# Altium project MB1936.PrjPcb (part 4 of 8)

## Sheet QSPI_NOR.SchDoc: QSPI_NOR
size A4; Date: Not used; ApprovedBy: Not used; CheckedBy: Not used; Author: Not used; CompanyName: STMicroelectronics; DrawnBy: Not used; Engineer: Not used; Organization: Not used; Address1: Not used; Address2: Not used; Address3: Not used; Address4: Not used; DocumentNumber: Not used; Revision: Not used; SheetNumber: 14; SheetTotal: 18; CurrentTime: Not used; CurrentDate: Not used; Time: Not used; DocumentFullPathAndName: Not used; DocumentName: Not used; ModifiedDate: Not used; ImagePath: Not used; ProjectName: Not used; Application_BuildNumber: Not used
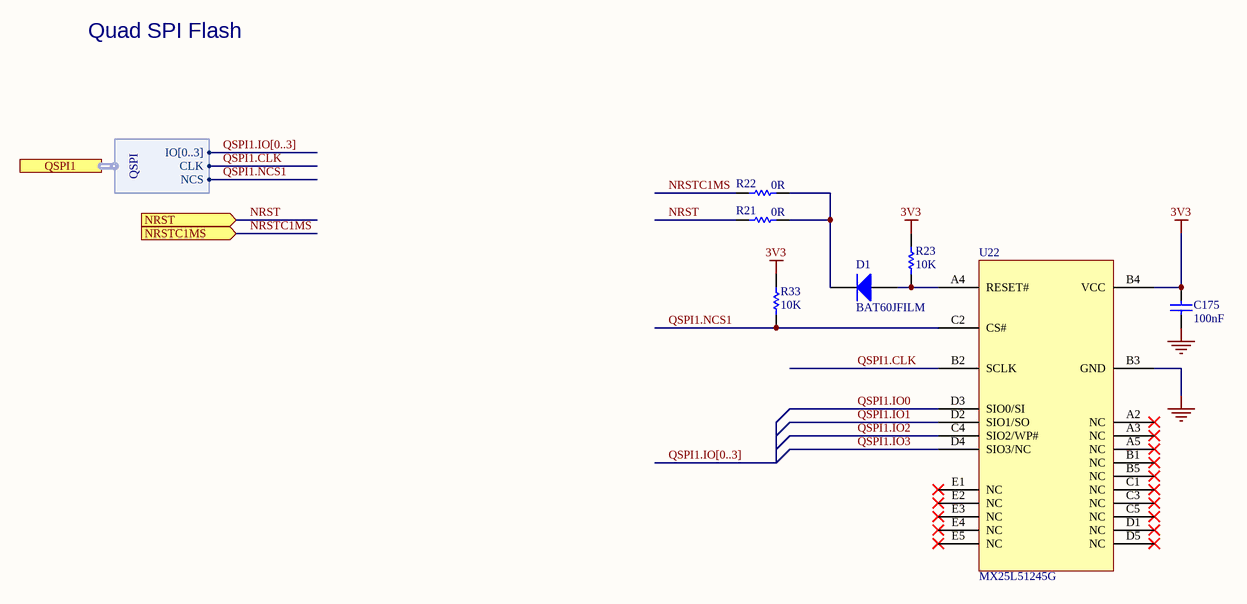
[diagram p10: QSPI_NOR.SchDoc]

### Parts
C175  value 100nF  [C0402]  (hidden comment: Capacitor)
D1  BAT60JFILM  [DIO_SOD323]
R21  value 0R  [R0402]  (hidden comment: Resistor)
R22  value 0R  [R0402]  (hidden comment: Resistor)
R23  value 10K  [R0402]  (hidden comment: Resistor)
R33  value 10K  [R0402]  (hidden comment: Resistor)
U22  MX25L51245G  [ICC_BGA24_5X5-BALL-ARRAY_6X8_P1]

### Ports
NRST (in), NRSTC1MS (in), QSPI1 (harness QSPI)

### Harnesses
QSPI: IO[0..3], CLK, NCS

### Nets
3V3: C175.2 R23.2 R33.2 U22.B4(VCC)
GND: C175.1 U22.B3(GND)
NRST: R21.1 ; port NRST
NRSTC1MS: R22.1 ; port NRSTC1MS
QSPI1.CLK: U22.B2(SCLK) ; port QSPI1.CLK
QSPI1.IO0: U22.D3(SIO0/SI)
QSPI1.IO1: U22.D2(SIO1/SO)
QSPI1.IO2: U22.C4(SIO2/WP#)
QSPI1.IO3: U22.D4(SIO3/NC)
QSPI1.NCS1: R33.1 U22.C2(CS#) ; port QSPI1.NCS
NetD1_1: D1.1(A) R23.1 U22.A4(RESET#)
NetD1_2: D1.2(K) R21.2 R22.2

Not connected (* = marked no-connect by the designer): U22 A2(NC)* A3(NC)* A5(NC)* B1(NC)* B5(NC)* C1(NC)* C3(NC)* C5(NC)* D1(NC)* D5(NC)* E1(NC)* E2(NC)* E3(NC)* E4(NC)* E5(NC)*

### Buses and harness runs
bus QSPI1.IO[0..3]

### Notes on the sheet
- Quad SPI Flash
- Title:
- Project:
- Size:
- Revision:
- Variant:
- A4
- -
- Date:
- Reference:
- Sheet:
- of

### Library data of the parts
C175 = MCD-00006: Capacitor, MLCC, 100nF, 16V, X7R, +/-10%, 0402, T=0.5mm; Part_Preference: Recommended; Manufacturer: YAGEO; Manufacturer_Part_Number: CC0402KRX7R7BB104; Order_Code_RS: 616-9701; Component_Country_Of_Origin: China; ShowFields: YES; ID: 2474; Internal_Part_Number: MCD-00006; Status: Released; Part_Type: Capacitor; Package: 0402; ComponentLink1URL: http://tunmcdsvn.tun.st.com/Component_Documentation_Library/Trunk/Capacitor/YAGEO_X7R_Series; Order_Code_Digikey: 311-1338-1-ND; Order_Code_Farnell: 9402047
D1 = MCD-00034: BMS_Part_Number: 9151097; Part_Type: Diode; Part_Preference: Recommended; Manufacturer: STMICROELECTRONICS; Manufacturer_HQ_COO: EU; Component_Country_Of_Origin: China; ShowFields: YES; ID: 2483; Internal_Part_Number: MCD-00034; Value: BAT60JFILM; Status: Released; Manufacturer_Part_Number: BAT60JFILM; ComponentLink1URL: http://tunmcdsvn.tun.st.com/Component_Datasheet_Library/Trunk/Diodes/STM_Diode_BAT60JFILM-SOD323
R21 R22 = MCD-00052: Resistor,0R,0402,5%,1/16W; Manufacturer_Part_Number: RC0402JR-070RL; Manufacturer: YAGEO; Part_Preference: Recommended; Order_Code_RS: 618-5804; Component_Country_Of_Origin: China; ID: 2540; ShowFields: YES; Internal_Part_Number: MCD-00052; Status: Released; Part_Type: Resistor; ComponentLink1Description: Datasheet; ComponentLink1URL: http://tunmcdsvn.tun.st.com/Component_Documentation_Library/Trunk/Resistor/YAGEO_RC_L_Series; Package: 0402; Order_Code_Digikey: 311-0.0JRCT-ND; Order_Code_Farnell: 9232516RL; Alternate_Manufacturer: N/A; Alternate_Manufacturer_Part_Number: N/A
R23 R33 = MCD-00053: Resistor,10K,0402,1%,1/16W; Manufacturer_Part_Number: RC0402FR-0710KL; Manufacturer: YAGEO; BMS_Part_Number: 9131590; ECCN_US: EAR99; ECCN_EU: NEC; Provided_By: SUBCO; Internal_Part_Number: MCD-00053; Status: Released; Part_Type: Resistor; Package: R0402; ComponentLink1Description: Datasheet; ComponentLink1URL: http://tunmcdsvn.tun.st.com/Component_Datasheet_Library/Trunk/Resistors/Yageo_Resistor_RC0402-series
U22 = MCD-00114: Memory,Serial-NOR,512Mb,3V; Part_Type: IC; Manufacturer: MACRONIX; ECCN_US: tbd; Provided_By: SUBCO; Internal_Part_Number: MCD-00114; Value: MX25L51245G; Status: Released; Manufacturer_Part_Number: MX25L51245G; ComponentLink1Description: Datasheet; ComponentLink1URL: http://tunmcdsvn.tun.st.com/Component_Datasheet_Library/Trunk/IC/Macronix_SerialNOR_MX25L51245Gver13; ECCN_EU: tbd

## Sheet Power_MPU.SchDoc: Power MPU
size A3; Date: Not used; ApprovedBy: Not used; CheckedBy: Not used; Author: Not used; CompanyName: STMicroelectronics; DrawnBy: Not used; Engineer: Not used; Organization: Not used; Address1: Not used; Address2: Not used; Address3: Not used; Address4: Not used; DocumentNumber: Not used; Revision: Not used; SheetNumber: 5; SheetTotal: 18; CurrentTime: Not used; CurrentDate: Not used; Time: Not used; DocumentFullPathAndName: Not used; DocumentName: Not used; ModifiedDate: Not used; ImagePath: Not used; ProjectName: Not used; Application_BuildNumber: Not used
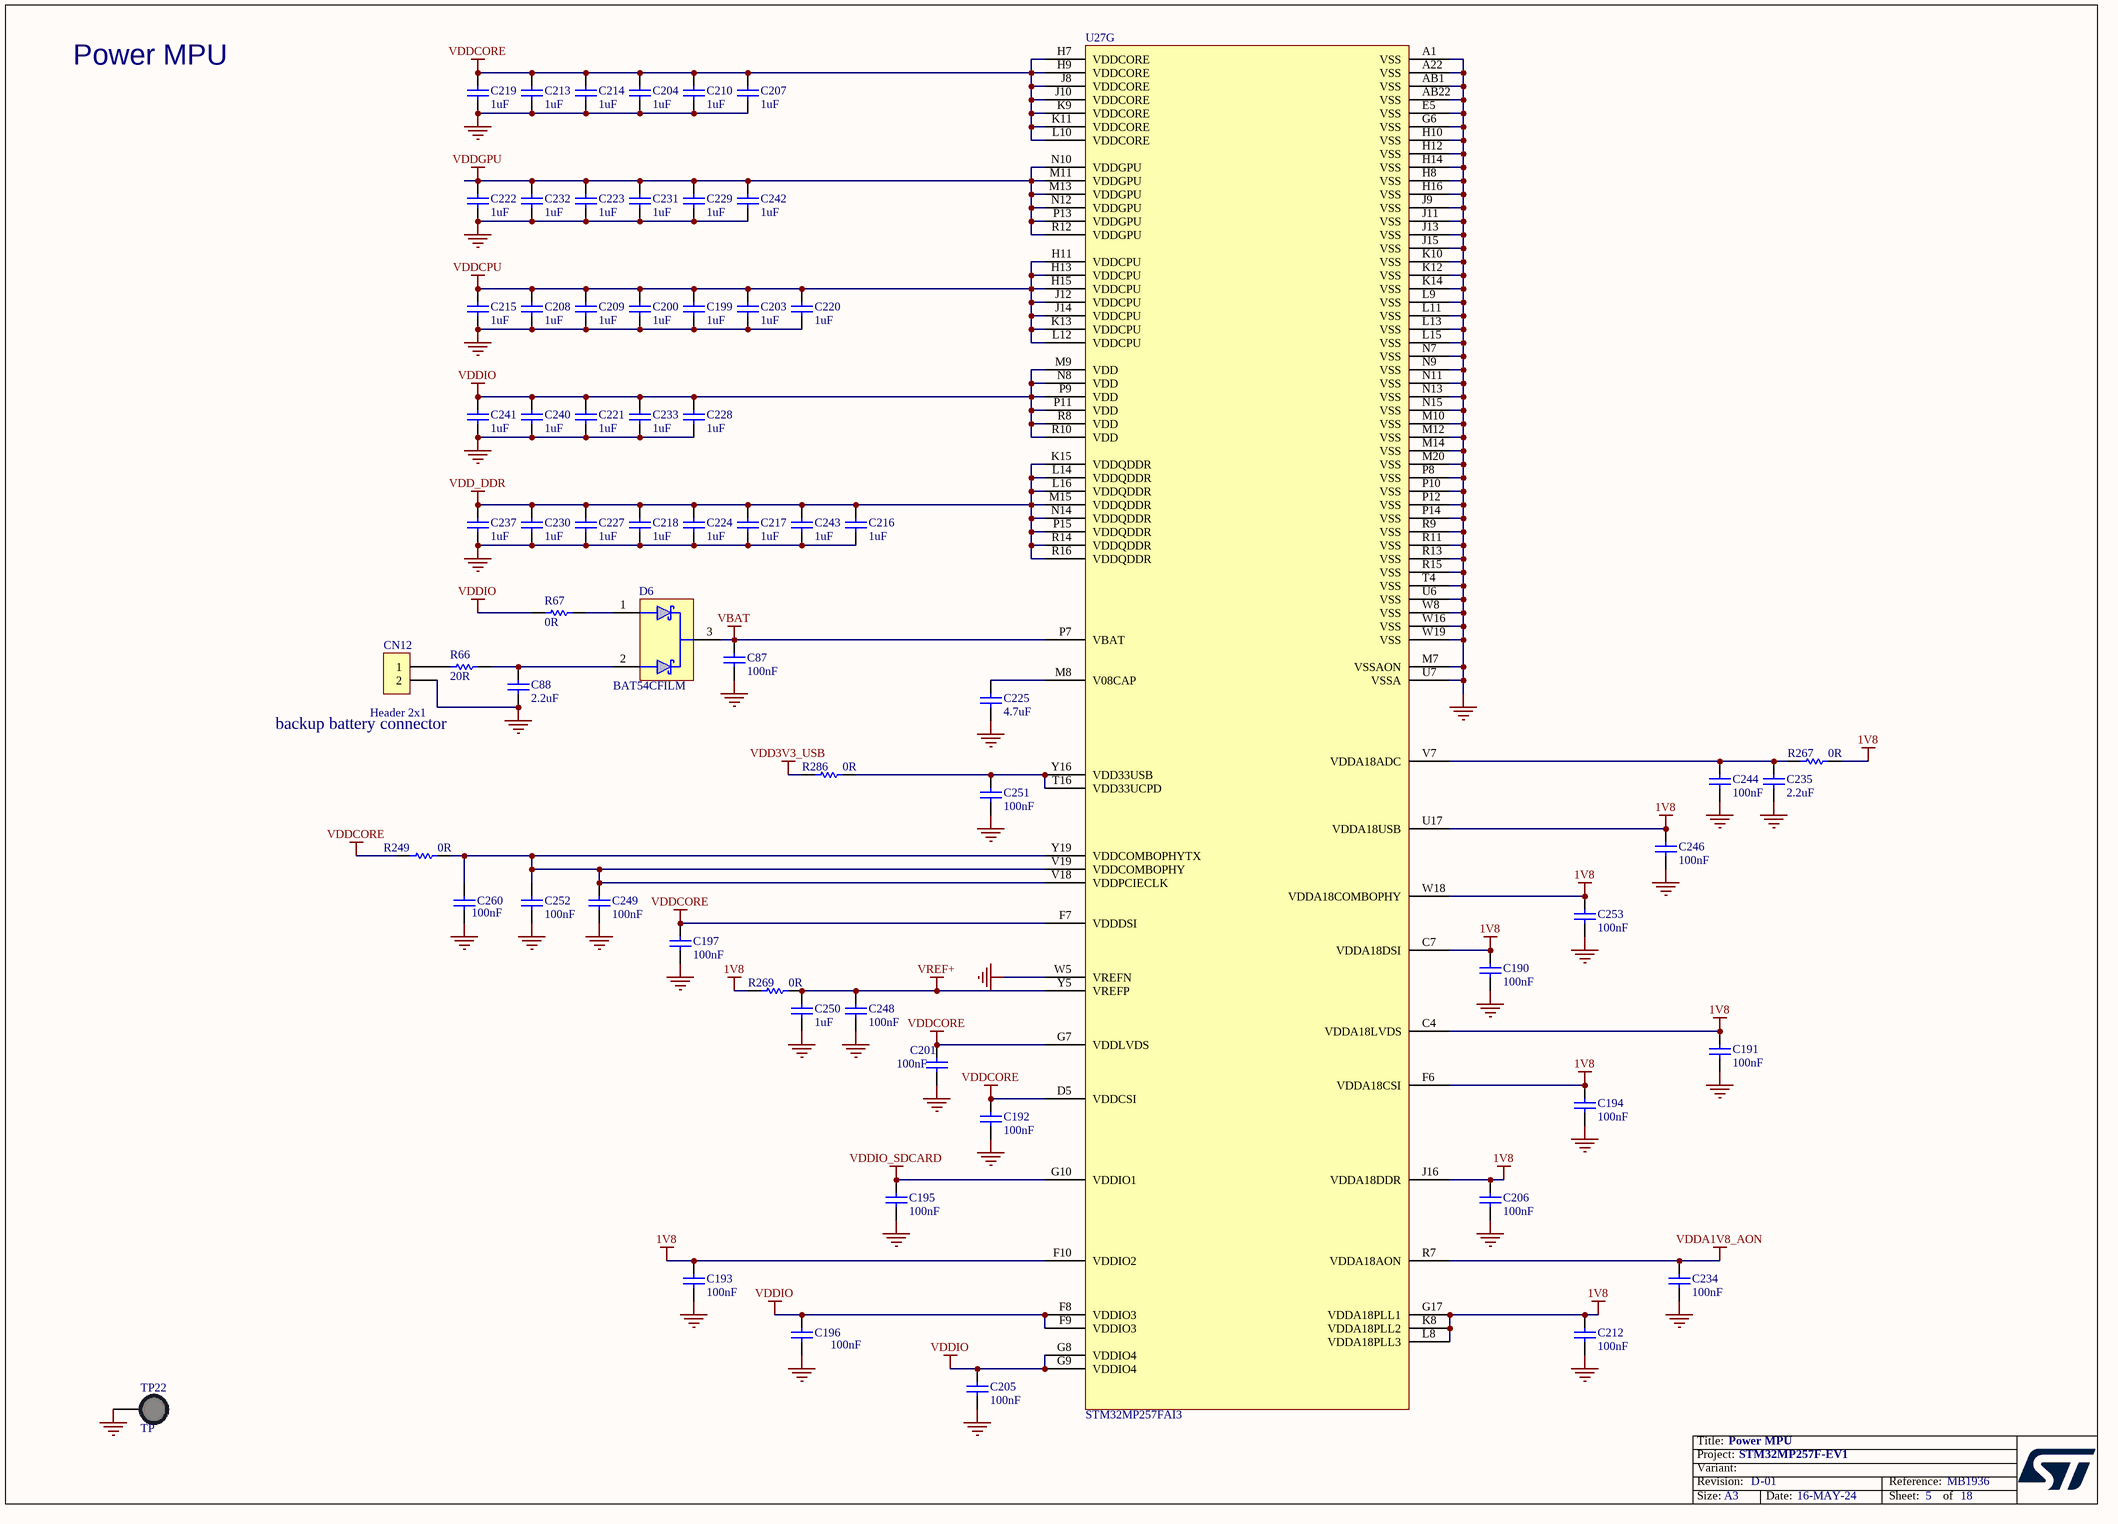
[diagram p11: Power_MPU.SchDoc]

### Parts
C87  value 100nF  [C0402]
C88  value 2.2uF  [C0402]  (hidden comment: Capacitor)
C190  value 100nF  [C0201_MURATA_GRM033_H0P3]  (hidden comment: Capacitor)
C191  value 100nF  [C0201_MURATA_GRM033_H0P3]  (hidden comment: Capacitor)
C192  value 100nF  [C0201_MURATA_GRM033_H0P3]  (hidden comment: Capacitor)
C193  value 100nF  [C0201_MURATA_GRM033_H0P3]  (hidden comment: Capacitor)
C194  value 100nF  [C0201_MURATA_GRM033_H0P3]  (hidden comment: Capacitor)
C195  value 100nF  [C0201_MURATA_GRM033_H0P3]  (hidden comment: Capacitor)
C196  value 100nF  [C0201_MURATA_GRM033_H0P3]  (hidden comment: Capacitor)
C197  value 100nF  [C0201_MURATA_GRM033_H0P3]  (hidden comment: Capacitor)
C199  value 1uF  [C0201_MURATA_GRM033_H0P3]  (hidden comment: Capacitor)
C200  value 1uF  [C0201_MURATA_GRM033_H0P3]  (hidden comment: Capacitor)
C201  value 100nF  [C0201_MURATA_GRM033_H0P3]  (hidden comment: Capacitor)
C203  value 1uF  [C0201_MURATA_GRM033_H0P3]  (hidden comment: Capacitor)
C204  value 1uF  [C0201_MURATA_GRM033_H0P3]  (hidden comment: Capacitor)
C205  value 100nF  [C0201_MURATA_GRM033_H0P3]  (hidden comment: Capacitor)
C206  value 100nF  [C0201_MURATA_GRM033_H0P3]  (hidden comment: Capacitor)
C207  value 1uF  [C0201_MURATA_GRM033_H0P3]  (hidden comment: Capacitor)
C208  value 1uF  [C0201_MURATA_GRM033_H0P3]  (hidden comment: Capacitor)
C209  value 1uF  [C0201_MURATA_GRM033_H0P3]  (hidden comment: Capacitor)
C210  value 1uF  [C0201_MURATA_GRM033_H0P3]  (hidden comment: Capacitor)
C212  value 100nF  [C0201_MURATA_GRM033_H0P3]  (hidden comment: Capacitor)
C213  value 1uF  [C0201_MURATA_GRM033_H0P3]  (hidden comment: Capacitor)
C214  value 1uF  [C0201_MURATA_GRM033_H0P3]  (hidden comment: Capacitor)
C215  value 1uF  [C0201_MURATA_GRM033_H0P3]  (hidden comment: Capacitor)
C216  value 1uF  [C0201_MURATA_GRM033_H0P3]  (hidden comment: Capacitor)
C217  value 1uF  [C0201_MURATA_GRM033_H0P3]  (hidden comment: Capacitor)
C218  value 1uF  [C0201_MURATA_GRM033_H0P3]  (hidden comment: Capacitor)
C219  value 1uF  [C0201_MURATA_GRM033_H0P3]  (hidden comment: Capacitor)
C220  value 1uF  [C0201_MURATA_GRM033_H0P3]  (hidden comment: Capacitor)
C221  value 1uF  [C0201_MURATA_GRM033_H0P3]  (hidden comment: Capacitor)
C222  value 1uF  [C0201_MURATA_GRM033_H0P3]  (hidden comment: Capacitor)
C223  value 1uF  [C0201_MURATA_GRM033_H0P3]  (hidden comment: Capacitor)
C224  value 1uF  [C0201_MURATA_GRM033_H0P3]  (hidden comment: Capacitor)
C225  value 4.7uF  [C0201_H0P5]  (hidden comment: Capacitor)
C227  value 1uF  [C0201_MURATA_GRM033_H0P3]  (hidden comment: Capacitor)
C228  value 1uF  [C0201_MURATA_GRM033_H0P3]  (hidden comment: Capacitor)
C229  value 1uF  [C0201_MURATA_GRM033_H0P3]  (hidden comment: Capacitor)
C230  value 1uF  [C0201_MURATA_GRM033_H0P3]  (hidden comment: Capacitor)
C231  value 1uF  [C0201_MURATA_GRM033_H0P3]  (hidden comment: Capacitor)
C232  value 1uF  [C0201_MURATA_GRM033_H0P3]  (hidden comment: Capacitor)
C233  value 1uF  [C0201_MURATA_GRM033_H0P3]  (hidden comment: Capacitor)
C234  value 100nF  [C0201_MURATA_GRM033_H0P3]  (hidden comment: Capacitor)
C235  value 2.2uF  [C0201_H0P5]  (hidden comment: Capacitor)
C237  value 1uF  [C0201_MURATA_GRM033_H0P3]  (hidden comment: Capacitor)
C240  value 1uF  [C0201_MURATA_GRM033_H0P3]  (hidden comment: Capacitor)
C241  value 1uF  [C0201_MURATA_GRM033_H0P3]  (hidden comment: Capacitor)
C242  value 1uF  [C0201_MURATA_GRM033_H0P3]  (hidden comment: Capacitor)
C243  value 1uF  [C0201_MURATA_GRM033_H0P3]  (hidden comment: Capacitor)
C244  value 100nF  [C0201_MURATA_GRM033_H0P3]  (hidden comment: Capacitor)
C246  value 100nF  [C0201_MURATA_GRM033_H0P3]  (hidden comment: Capacitor)
C248  value 100nF  [C0201_MURATA_GRM033_H0P3]  (hidden comment: Capacitor)
C249  value 100nF  [C0201_MURATA_GRM033_H0P3]  (hidden comment: Capacitor)
C250  value 1uF  [C0201_MURATA_GRM033_H0P3]  (hidden comment: Capacitor)
C251  value 100nF  [C0201_MURATA_GRM033_H0P3]  (hidden comment: Capacitor)
C252  value 100nF  [C0201_MURATA_GRM033_H0P3]  (hidden comment: Capacitor)
C253  value 100nF  [C0201_MURATA_GRM033_H0P3]  (hidden comment: Capacitor)
C260  value 100nF  [C0201_MURATA_GRM033_H0P3]  (hidden comment: Capacitor)
CN12  value Header 2x1  [CON_MOLEX_53047-0210]
D6  value BAT54CFILM  [DIO_SOT23]  (hidden comment: DIODE_3P_DUAL_COMMON_CATHODE)
R66  value 20R  [R0402]  (hidden comment: Resistor)
R67  value 0R  [R0402]  (hidden comment: Resistor)
R249  value 0R  [R0603]  (hidden comment: Resistor)
R267  value 0R  [R0402]
R269  value 0R  [R0402]
R286  value 0R  [R0402]
TP22  value TP  [TP_PTH-1P02MM_TEST-TERMINAL_RS_101-2391_BLACK]  (hidden comment: Test_pin_conn_black)
U27  STM32MP257FAI3  [ICC_LFBGA436_18X18_P080_H1P70_STM32MP257_CODE-B0D1]  (part G of 9)

### Nets
1V8: C190.2 C191.2 C193.2 C194.2 C206.2 C212.2 C246.2 C253.2 R267.2 R269.1 U27.C4(VDDA18LVDS) U27.C7(VDDA18DSI) U27.F6(VDDA18CSI) U27.F10(VDDIO2) U27.G17(VDDA18PLL1) U27.J16(VDDA18DDR) U27.K8(VDDA18PLL2) U27.L8(VDDA18PLL3) U27.U17(VDDA18USB) U27.W18(VDDA18COMBOPHY)
GND: C87.1 C88.1 C190.1 C191.1 C192.1 C193.1 C194.1 C195.1 C196.1 C197.1 C199.1 C200.2 C201.1 C203.1 C204.2 C205.1 C206.1 C207.1 C208.1 C209.1 C210.1 C212.1 C213.1 C214.1 C215.2 C216.1 C217.1 C218.1 C219.2 C220.1 C221.1 C222.1 C223.1 C224.1 C225.1 C227.1 C228.1 C229.2 C230.2 C231.1 C232.1 C233.2 C234.1 C235.1 C237.1 C240.1 C241.2 C242.1 C243.1 C244.1 C246.1 C248.1 C249.1 C250.1 C251.1 C252.1 C253.1 C260.1 CN12.2 TP22.1 U27.A1(VSS) U27.A22(VSS) U27.AB1(VSS) U27.AB22(VSS) U27.E5(VSS) U27.G6(VSS) U27.H8(VSS) U27.H10(VSS) U27.H12(VSS) U27.H14(VSS) U27.H16(VSS) U27.J9(VSS) U27.J11(VSS) U27.J13(VSS) U27.J15(VSS) U27.K10(VSS) U27.K12(VSS) U27.K14(VSS) U27.L9(VSS) U27.L11(VSS) U27.L13(VSS) U27.L15(VSS) U27.M7(VSSAON) U27.M10(VSS) U27.M12(VSS) U27.M14(VSS) U27.M20(VSS) U27.N7(VSS) U27.N9(VSS) U27.N11(VSS) U27.N13(VSS) U27.N15(VSS) U27.P8(VSS) U27.P10(VSS) U27.P12(VSS) U27.P14(VSS) U27.R9(VSS) U27.R11(VSS) U27.R13(VSS) U27.R15(VSS) U27.T4(VSS) U27.U6(VSS) U27.U7(VSSA) U27.W5(VREFN) U27.W8(VSS) U27.W16(VSS) U27.W19(VSS)
VBAT: C87.2 D6.3 U27.P7(VBAT)
VDD3V3_USB: R286.1
VDD_DDR: C216.2 C217.2 C218.2 C224.2 C227.2 C230.1 C237.2 C243.2 U27.K15(VDDQDDR) U27.L14(VDDQDDR) U27.L16(VDDQDDR) U27.M15(VDDQDDR) U27.N14(VDDQDDR) U27.P15(VDDQDDR) U27.R14(VDDQDDR) U27.R16(VDDQDDR)
VDDA1V8_AON: C234.2 U27.R7(VDDA18AON)
VDDCORE: C192.2 C197.2 C201.2 C204.1 C207.2 C210.2 C213.2 C214.2 C219.1 R249.1 U27.D5(VDDCSI) U27.F7(VDDDSI) U27.G7(VDDLVDS) U27.H7(VDDCORE) U27.H9(VDDCORE) U27.J8(VDDCORE) U27.J10(VDDCORE) U27.K9(VDDCORE) U27.K11(VDDCORE) U27.L10(VDDCORE)
VDDCPU: C199.2 C200.1 C203.2 C208.2 C209.2 C215.1 C220.2 U27.H11(VDDCPU) U27.H13(VDDCPU) U27.H15(VDDCPU) U27.J12(VDDCPU) U27.J14(VDDCPU) U27.K13(VDDCPU) U27.L12(VDDCPU)
VDDGPU: C222.2 C223.2 C229.1 C231.2 C232.2 C242.2 U27.M11(VDDGPU) U27.M13(VDDGPU) U27.N10(VDDGPU) U27.N12(VDDGPU) U27.P13(VDDGPU) U27.R12(VDDGPU)
VDDIO: C196.2 C205.2 C221.2 C228.2 C233.1 C240.2 C241.1 R67.2 U27.F8(VDDIO3) U27.F9(VDDIO3) U27.G8(VDDIO4) U27.G9(VDDIO4) U27.M9(VDD) U27.N8(VDD) U27.P9(VDD) U27.P11(VDD) U27.R8(VDD) U27.R10(VDD)
VDDIO_SDCARD: C195.2 U27.G10(VDDIO1)
VREF+: C248.2 C250.2 R269.2 U27.Y5(VREFP)
NetC88_2: C88.2 D6.2 R66.2
NetC225_2: C225.2 U27.M8(V08CAP)
NetC235_2: C235.2 C244.2 R267.1 U27.V7(VDDA18ADC)
NetC249_2: C249.2 C252.2 C260.2 R249.2 U27.V18(VDDPCIECLK) U27.V19(VDDCOMBOPHY) U27.Y19(VDDCOMBOPHYTX)
NetC251_2: C251.2 R286.2 U27.T16(VDD33UCPD) U27.Y16(VDD33USB)
NetCN12_1: CN12.1 R66.1
NetD6_1: D6.1 R67.1

### Notes on the sheet
- Power MPU
- backup battery connector
- Title:
- Project:
- Size:
- Revision:
- Variant:
- A3
- -
- Date:
- Reference:
- Sheet:
- of

### Library data of the parts
C87 = MCD-00006: Capacitor,100nF,16V,X7R,10%,0402; Manufacturer_Part_Number: CC0402KRX7R7BB104; Manufacturer: YAGEO; Alternate_Manufacturer: MURATA; Alternate_Manufacturer_Part_Number: GCM155R71C104KA55D; Part_Preference: Recommended; Partial_Alternate_Internal_Part_Number: MCD-03299; Provided_By: SUBCO; Initial_Board_Reference: MB1274; Order_Code_RS: 616-9701; Component_Country_Of_Origin: China; ID: 2474; ShowFields: YES; Alternate_EMS: M; Internal_Part_Number: MCD-00006; ComponentLink1Description: Datasheet; ECCN_US: n/a; ECCN_EU: n/a; Status: Released; Part_Type: Capacitor; Package: 0402; ComponentLink1URL: http://tunmcdsvn.tun.st.com/Component_Documentation_Library/Trunk/Capacitor/YAGEO_X7R_Series; Order_Code_Digikey: 311-1338-1-ND; Order_Code_Farnell: 9402047
C88 = MCD-01823: Capacitor, MLCC, 2.2uF, 6V3, X5R,+/-10%, 0402, T=0.5mm; Part_Preference: Recommended; Manufacturer: MURATA; Manufacturer_Part_Number: GRM155R60J225KE95D; Order_Code_RS: 172-6478; Component_Country_Of_Origin: Japan; ID: 3923; ShowFields: YES; Internal_Part_Number: MCD-01823; Status: Released; Part_Type: Capacitor; Alternate_Manufacturer: N/A; Alternate_Manufacturer_Part_Number: N/A; Package: 0402; ComponentLink1URL: http://tunmcdsvn.tun.st.com/Component_Documentation_Library/Trunk/Capacitor/MURATA_GRM_Series; Order_Code_Digikey: 490-12532-1-ND; Order_Code_Farnell: 2695865
C190-C197 C201 C205 C206 C212 C234 C244 C246 C248 C249 C251-C253 C260 = MCD-01535: Capacitor, MLCC,100nF, 10V, X7R, +/-10%, 0201, T=0.3mm; Part_Preference: Recommended; Manufacturer: MURATA; Manufacturer_Part_Number: GRM033R61A104KE15; Order_Code_RS: 790-2742; Internal_Part_Number: MCD-01535; Status: Checked; Part_Type: Capacitor; Alternate_Manufacturer: N/A; Alternate_Manufacturer_Part_Number: N/A; Package: 0201; ComponentLink1URL: http://tunmcdsvn.tun.st.com/Component_Documentation_Library/Trunk/Capacitor/MURATA_GRM_Series; Order_Code_Digikey: 490-5881-1-ND; Order_Code_Farnell: 2470450
C199 C200 C203 C204 C207-C210 C213-C224 C227-C233 C237 C240-C243 C250 = MCD-02377: Capacitor, MLCC, 1uF, 6.3V, X5R, +/-20%, 0201, T=0,3mm; Manufacturer_Part_Number: GRM033R60J105MEA2; Manufacturer: MURATA; Part_Preference: Recommended; Order_Code_RS: 820-0643; Status: Checked; Internal_Part_Number: MCD-02377; Part_Type: Capacitor; Alternate_Manufacturer_Part_Number: N/A; Alternate_Manufacturer: N/A; Package: 0201; ComponentLink1URL: http://tunmcdsvn.tun.st.com/Component_Documentation_Library/Trunk/Capacitor/MURATA_GRM_Series/GRM033R60J105MEA2/; Order_Code_Digikey: 490-7229-2-ND; Order_Code_Farnell: 2470448
C225 = MCD-01534: Capacitor, MLCC, 4,7uF, 6V3, X5R, +/-20%, 0201, T=0.5mm; Part_Preference: Recommended; Manufacturer: MURATA; Manufacturer_Part_Number: GRM035R60J475ME15; Internal_Part_Number: MCD-01534; Status: Checked; Part_Type: Capacitor; Alternate_Manufacturer: N/A; Alternate_Manufacturer_Part_Number: N/A; Package: 0201; ComponentLink1URL: http://tunmcdsvn.tun.st.com/Component_Documentation_Library/Trunk/Capacitor/MURATA_GRM_Series; Order_Code_Digikey: 490-13230-1-ND; Order_Code_Farnell: N/A; Order_Code_RS: N/A
C235 = MCD-02235: Capacitor, MLCC, 2.2uF, 10V, X5R,+/-10%, 0201, T=0.5mm; Part_Preference: Recommended; Manufacturer: MURATA; Manufacturer_Part_Number: GRM033R61A225KE47D; Order_Code_RS: NA; Component_Country_Of_Origin: Japan; ShowFields: YES; ID: 4335; Internal_Part_Number: MCD-02235; Status: Checked; Part_Type: Capacitor; Package: 0201; ComponentLink1URL: http://tunmcdsvn.tun.st.com/Component_Documentation_Library/Trunk/Capacitor/MURATA_GRM_Series; Order_Code_Digikey: 490-13227-1-ND; Order_Code_Farnell: NA
CN12 = MCD-00655: Header 2 circuits, 1.25mm Pitch ,  Vertical, with Friction Lock; Part_Type: Connector; Manufacturer_Part_Number: 53047-0210; Manufacturer: MOLEX; BMS_Part_Number: 9083002; Part_Preference: Recommended; Provided_By: SUBCO; Initial_Board_Reference: MB1272; Order_Code_RS: 279-9213; Component_Country_Of_Origin: Unknown; ID: 3091; ShowFields: YES; Internal_Part_Number: MCD-00655; Status: Released; ComponentLink1Description: Datasheet; ComponentLink1URL: http://tunmcdsvn.tun.st.com/Component_Documentation_Library/Trunk/Connector/MOLEX_53047-0210/; ECCN_US: n/a; ECCN_EU: n/a; Alternate_Manufacturer: N/A; Alternate_Manufacturer_Part_Number: N/A; Order_Code_Digikey: WM1731-ND; Order_Code_Farnell: 9733051
D6 = MCD-03280: Diode, Schottky, Dual Common Cathode, 0V3, 300mA, 40V, SOT-23; Part_Preference: Recommended; Manufacturer: STMICROELECTRONICS; Full_Alternate_Internal_Part_Number: BAT54C+, BAT54CLT1G, BAT54C-7-F, BAT54C,215; Order_code_RS: 795-8397; Component_Country_Of_Origin: China; ShowFields: YES; ID: 5396; Order_code_Digikey: N/A; Order_code_Farnell: 9801499; Status: New; ComponentLink1URL: http://tunmcdsvn.tun.st.com/Component_Documentation_Library/Trunk/Diode/STMICROELECTRONICS_BAT54_Series; Internal_Part_Number: MCD-03280; Part_Type: Diode; Manufacturer_Part_Number: BAT54CFILM; Package: SOT-23
R66 = MCD-00058: Resistor, 20R, 0402, +/-1%, 1/16W; BMS_Part_Number: 9131027; Part_Preference: Recommended; Manufacturer: YAGEO; Manufacturer_Part_Number: RC0402FR-0720RL; Component_Country_Of_Origin: China; ID: 2537; ShowFields: YES; Internal_Part_Number: MCD-00058; Status: Released; Part_Type: Resistor; Alternate_Manufacturer: N/A; Alternate_Manufacturer_Part_Number: N/A; Package: 0402; ComponentLink1URL: http://tunmcdsvn.tun.st.com/Component_Documentation_Library/Trunk/Resistor/YAGEO_RC_L_Series; Order_Code_Digikey: 311-20LRCT-ND; Order_Code_Farnell: 1799192; Order_Code_RS: N/A
R67 = MCD-00052: Resistor, 0R, 0402, +/-5%, 1/16W; Manufacturer_Part_Number: RC0402JR-070RL; Manufacturer: YAGEO; Part_Preference: Recommended; Order_Code_RS: 618-5804; Component_Country_Of_Origin: China; ShowFields: YES; ID: 2540; Internal_Part_Number: MCD-00052; Status: Released; Part_Type: Resistor; ComponentLink1URL: http://tunmcdsvn.tun.st.com/Component_Documentation_Library/Trunk/Resistor/YAGEO_RC_L_Series; Package: 0402; Order_Code_Digikey: 311-0.0JRCT-ND; Order_Code_Farnell: 9232516RL
R249 = MCD-00056: Resistor, 0R, 0603, +/-5%, 1/10W; Part_Preference: Recommended; Manufacturer: YAGEO; Manufacturer_Part_Number: RC0603JR-070RL; Component_Country_Of_Origin: China; ShowFields: YES; ID: 2536; Internal_Part_Number: MCD-00056; Status: Released; Part_Type: Resistor; Package: 0603; ComponentLink1URL: http://tunmcdsvn.tun.st.com/Component_Documentation_Library/Trunk/Resistor/YAGEO_RC_L_Series; Order_Code_Digikey: 311-0.0GRCT-ND; Order_Code_Farnell: 9233130RL; Order_Code_RS: N/A
R267 R269 R286 = MCD-00052: Resistor,0R,0402,5%,1/16W; Manufacturer_Part_Number: RC0402JR-070RL; Manufacturer: YAGEO; Part_Preference: Recommended; ECCN_US: EAR99; ECCN_EU: NEC; Provided_By: SUBCO; Initial_Board_Reference: mb1274; Order_Code_RS: 618-5804; Internal_Part_Number: MCD-00052; ComponentLink1Description: Datasheet; Status: Released; Part_Type: Resistor; ComponentLink1URL: http://tunmcdsvn.tun.st.com/Component_Documentation_Library/Trunk/Resistor/YAGEO_RC_L_Series; Package: 0402; Alternate_Manufacturer: N/A; Alternate_Manufacturer_Part_Number: N/A; Order_Code_Digikey: 311-0.0JRCT-ND; Order_Code_Farnell: 9232516RL
TP22 = MCD-00713: Vero Technologies 1.02mm Black Terminal Post; Part_Type: Misc; Manufacturer_Part_Number: 20-2137; Part_Preference: Recommended; Order_Code_RS: 101-2391; Provided_By: SUBCO; Internal_Part_Number: MCD-00713; Status: Released; Manufacturer: VERO; ComponentLink1Description: Datasheet; ComponentLink1URL: http://tunmcdsvn.tun.st.com/Component_Datasheet_Library/Trunk/Misc/Vero_TestPin_20-2137; ECCN_US: n/a; ECCN_EU: n/a
U27 = MCD-02000: MPU, ARM Cortex-A35 + M33 32-bit MPU, 808KB RAM, With Crypto; Part_Type: IC; Part_Preference: Recommended; Manufacturer: STMICROELECTRONICS; Manufacturer_HQ_COO: EU; Component_Country_Of_Origin: Unknown; ShowFields: YES; ID: 4100; Internal_Part_Number: MCD-02000; Value: STM32MP257FAI3; Status: Checked; Manufacturer_Part_Number: STM32MP257FAI3; Package: LFBGA-436; ComponentLink1URL: http://tunmcdsvn.tun.st.com/Component_Documentation_Library/Trunk/IC/STMICROELECTRONICS_STM32MP257FAI3; Order_Code_Digikey: N/A; Order_Code_Farnell: N/A; Order_Code_RS: N/A

## Sheet USB_HUB.SchDoc: USB_HUB
size A3; Date: Not used; ApprovedBy: Not used; CheckedBy: Not used; Author: Not used; CompanyName: STMicroelectronics; DrawnBy: Not used; Engineer: Not used; Organization: Not used; Address1: Not used; Address2: Not used; Address3: Not used; Address4: Not used; DocumentNumber: Not used; Revision: Not used; SheetNumber: 12; SheetTotal: 18; CurrentTime: Not used; CurrentDate: Not used; Time: Not used; DocumentFullPathAndName: Not used; DocumentName: Not used; ModifiedDate: Not used; ImagePath: Not used; ProjectName: Not used; Application_BuildNumber: Not used
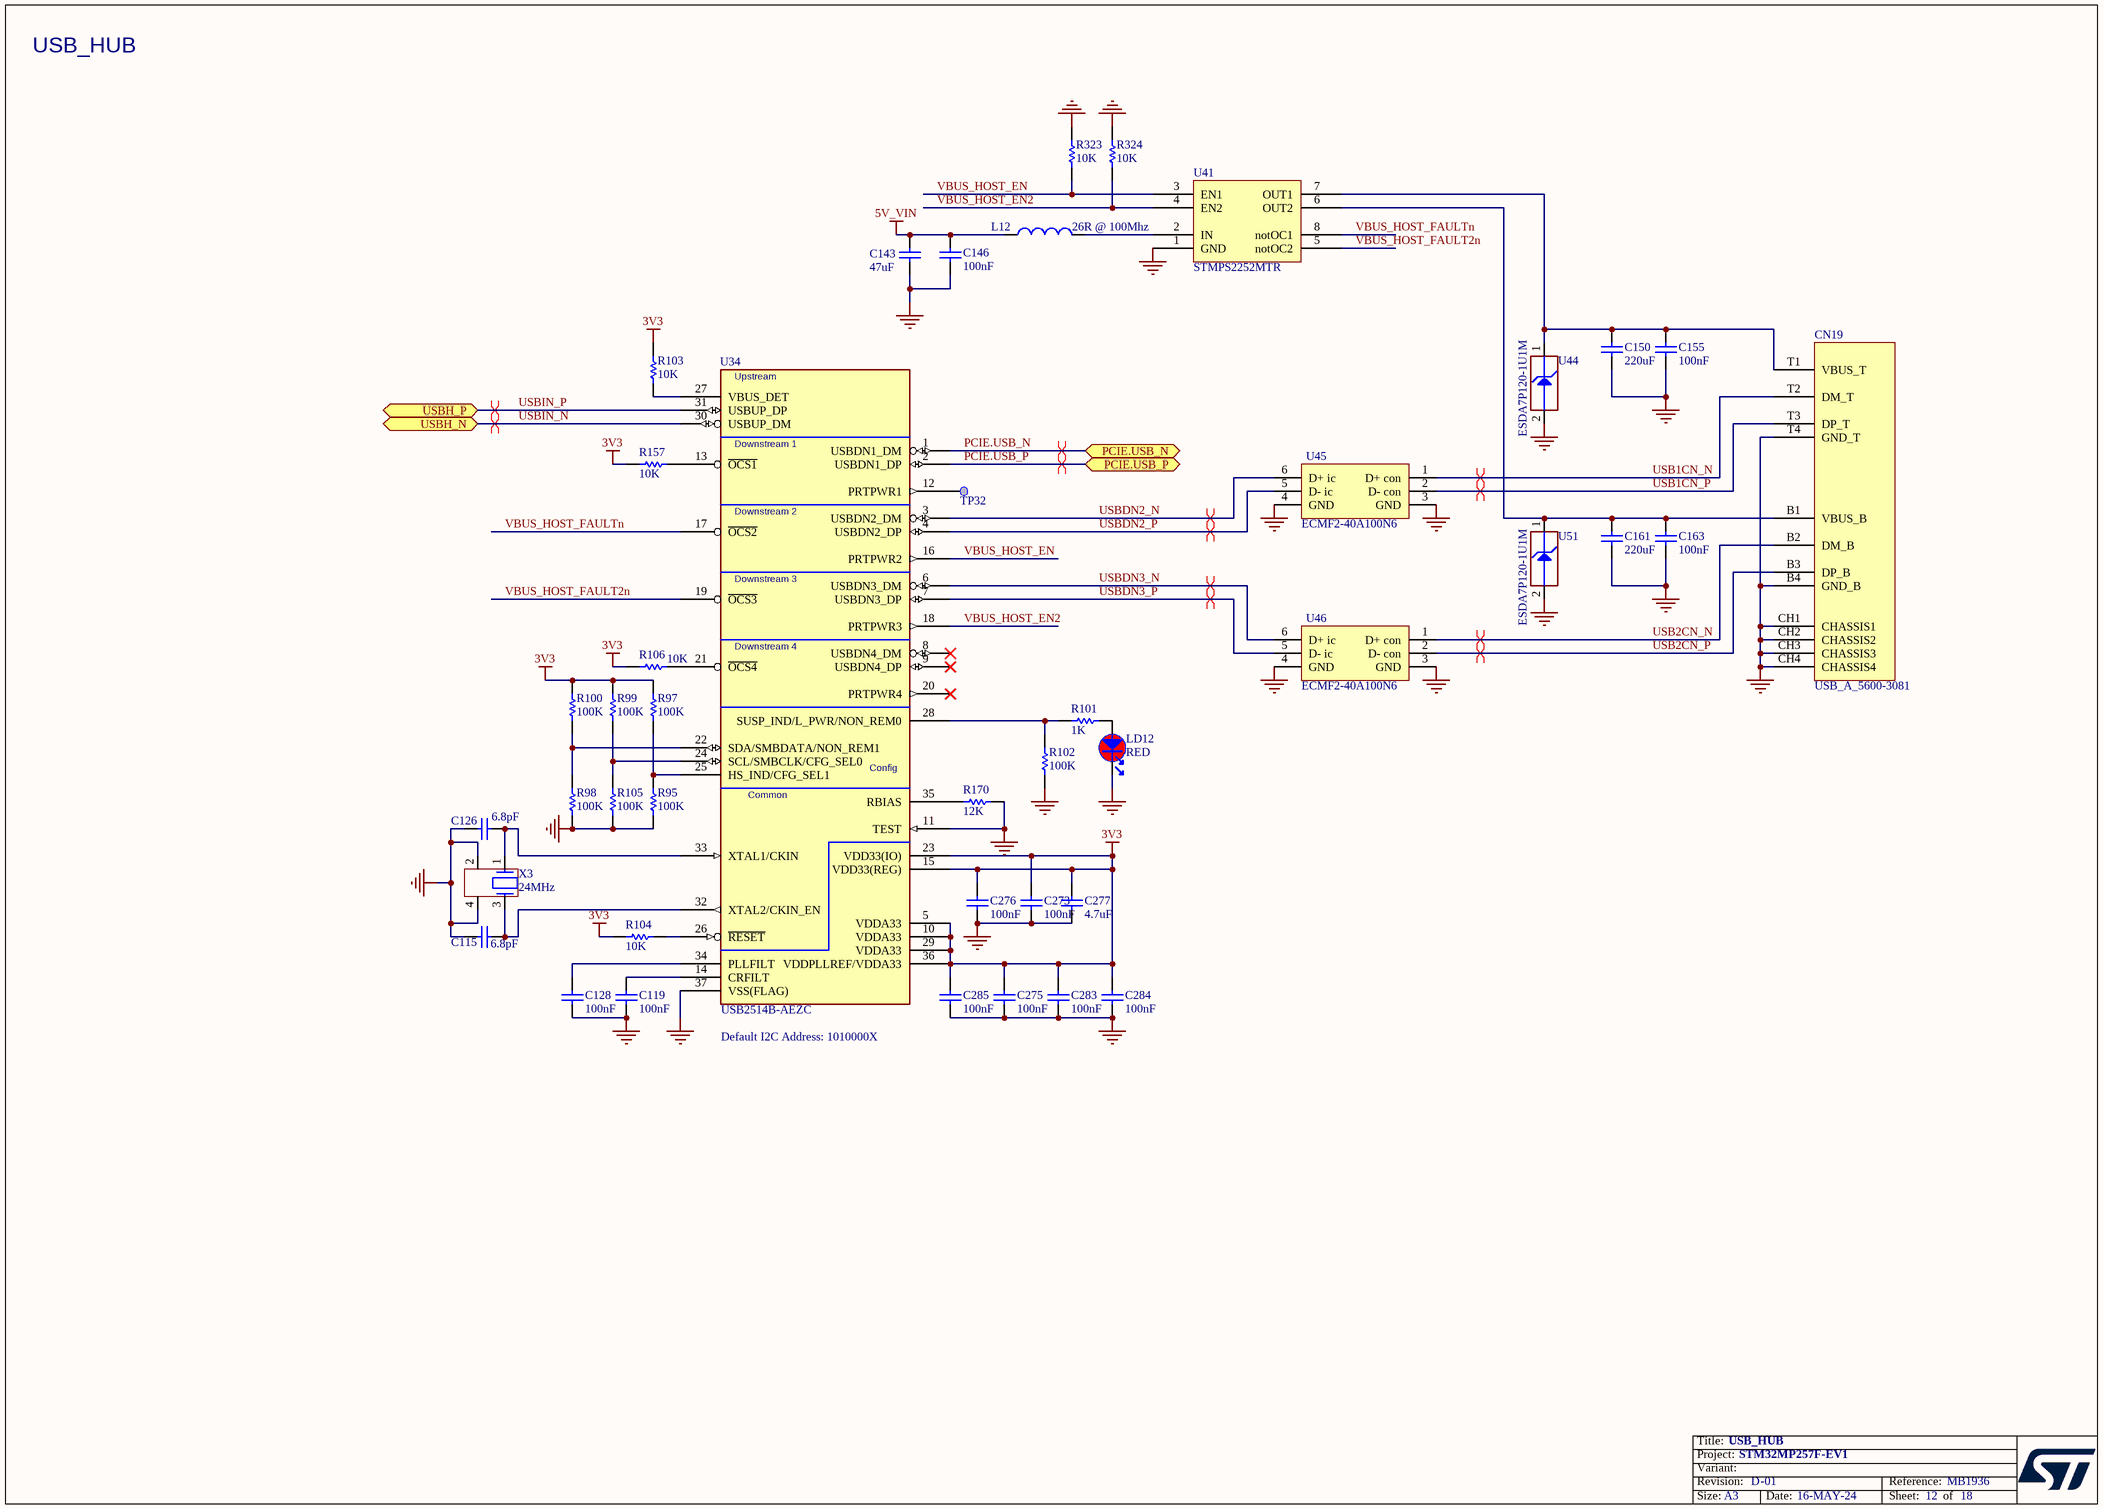
[diagram p12: USB_HUB.SchDoc]

### Parts
C115  value 6.8pF  [C0402]  (hidden comment: Capacitor)
C119  value 100nF  [C0402]  (hidden comment: Capacitor)
C126  value 6.8pF  [C0402]  (hidden comment: Capacitor)
C128  value 100nF  [C0402]  (hidden comment: Capacitor)
C143  value 47uF  [C0805]  (hidden comment: Capacitor)
C146  value 100nF  [C0402]  (hidden comment: Capacitor)
C150  value 220uF  [C1206_H1P6]  (hidden comment: Capacitor)
C155  value 100nF  [C0402]  (hidden comment: Capacitor)
C161  value 220uF  [C1206_H1P6]  (hidden comment: Capacitor)
C163  value 100nF  [C0402]  (hidden comment: Capacitor)
C273  value 100nF  [C0402]  (hidden comment: Capacitor)
C275  value 100nF  [C0402]  (hidden comment: Capacitor)
C276  value 100nF  [C0402]  (hidden comment: Capacitor)
C277  value 4.7uF  [C0402]  (hidden comment: Capacitor)
C283  value 100nF  [C0402]  (hidden comment: Capacitor)
C284  value 100nF  [C0402]  (hidden comment: Capacitor)
C285  value 100nF  [C0402]  (hidden comment: Capacitor)
CN19  value USB_A_5600-3081  [CON_DUAL-USB-TYPE-A_CONEXCON_5600-3081]  (hidden comment: USB_DUAL_TYPEA_5600-3081)
L12  value 26R @ 100Mhz  [FIL_0603_H0P65]  (hidden comment: BEAD)
LD12  value RED  [LED_0603_VISHAY_VLMS1300-GS08_RED_1A2K_H0P8]  (hidden comment: LED_red)
R95  value 100K  [R0402]  (hidden comment: Resistor)
R97  value 100K  [R0402]  (hidden comment: Resistor)
R98  value 100K  [R0402]  (hidden comment: Resistor)
R99  value 100K  [R0402]  (hidden comment: Resistor)
R100  value 100K  [R0402]  (hidden comment: Resistor)
R101  value 1K  [R0402]  (hidden comment: Resistor)
R102  value 100K  [R0402]  (hidden comment: Resistor)
R103  value 10K  [R0402]  (hidden comment: Resistor)
R104  value 10K  [R0402]  (hidden comment: Resistor)
R105  value 100K  [R0402]  (hidden comment: Resistor)
R106  value 10K  [R0402]  (hidden comment: Resistor)
R157  value 10K  [R0402]  (hidden comment: Resistor)
R170  value 12K  [R0402]  (hidden comment: Resistor)
R323  value 10K  [R0402]  (hidden comment: Resistor)
R324  value 10K  [R0402]  (hidden comment: Resistor)
TP32  Test Point  [TP_SMD_1MM]  (value not drawn)  (no BOM)
U34  USB2514B-AEZC  [ICC_QFN36-EPAD_6X6_P050]
U41  STMPS2252MTR  [ICC_SO8_5X4_P127]
U44  value ESDA7P120-1U1M  [ESD_QFN1610_2N_1K_2A]  (hidden comment: ESD-TRANSIL)
U45  ECMF2-40A100N6  [ESD_UQFN-6L_1P45X1P4_P040]
U46  ECMF2-40A100N6  [ESD_UQFN-6L_1P45X1P4_P040]
U51  value ESDA7P120-1U1M  [ESD_QFN1610_2N_1K_2A]  (hidden comment: ESD-TRANSIL)
X3  value 24MHz  [CRY_NX2016SA_4P]  (hidden comment: XTAL_4_PINS)

### Ports
PCIE.USB_N (bidir), PCIE.USB_P (bidir), USBH_N (bidir), USBH_P (bidir)

### Nets
3V3: C273.2 C275.2 C276.2 C277.2 C283.2 C284.2 C285.2 R97.2 R99.2 R100.2 R103.2 R104.1 R106.2 R157.2 U34.5(VDDA33) U34.10(VDDA33) U34.15(VDD33(REG)) U34.23(VDD33(IO)) U34.29(VDDA33) U34.36(VDDPLLREF/VDDA33)
5V_VIN: C143.2 C146.2 L12.1
GND: C115.1 C119.1 C126.1 C128.1 C143.1 C146.1 C150.1 C155.1 C161.1 C163.1 C273.1 C275.1 C276.1 C277.1 C283.1 C284.1 C285.1 CN19.B4(GND_B) CN19.CH1(CHASSIS1) CN19.CH2(CHASSIS2) CN19.CH3(CHASSIS3) CN19.CH4(CHASSIS4) CN19.T4(GND_T) LD12.2 R95.1 R98.1 R102.1 R105.1 R170.1 R323.1 R324.1 U34.11(TEST) U34.37(VSS(FLAG)) U41.1(GND) U44.2(GND) U45.3(GND) U45.4(GND) U46.3(GND) U46.4(GND) U51.2(GND) X3.2 X3.4
PCIE.USB_N: U34.1(USBDN1_DM) ; port PCIE.USB_N
PCIE.USB_P: U34.2(USBDN1_DP) ; port PCIE.USB_P
USB1CN_N: CN19.T2(DM_T) U45.1(D+_con)
USB1CN_P: CN19.T3(DP_T) U45.2(D-_con)
USB2CN_N: CN19.B2(DM_B) U46.1(D+_con)
USB2CN_P: CN19.B3(DP_B) U46.2(D-_con)
USBDN2_N: U34.3(USBDN2_DM) U45.6(D+_ic)
USBDN2_P: U34.4(USBDN2_DP) U45.5(D-_ic)
USBDN3_N: U34.6(USBDN3_DM) U46.6(D+_ic)
USBDN3_P: U34.7(USBDN3_DP) U46.5(D-_ic)
USBIN_N: U34.30(USBUP_DM) ; port USBH_N  [project net USBH_N]
USBIN_P: U34.31(USBUP_DP) ; port USBH_P  [project net USBH_P]
VBUS_HOST_EN: R323.2 U34.16(PRTPWR2) U41.3(EN1)
VBUS_HOST_EN2: R324.2 U34.18(PRTPWR3) U41.4(EN2)
VBUS_HOST_FAULT2n: U34.19(~{OCS3}) U41.5(notOC2)
VBUS_HOST_FAULTn: U34.17(~{OCS2}) U41.8(notOC1)
NetC115_2: C115.2 U34.32(XTAL2/CKIN_EN) X3.3
NetC119_2: C119.2 U34.14(CRFILT)
NetC126_2: C126.2 U34.33(XTAL1/CKIN) X3.1
NetC128_2: C128.2 U34.34(PLLFILT)
NetC150_2: C150.2 C155.2 CN19.T1(VBUS_T) U41.7(OUT1) U44.1(IO1)
NetC161_2: C161.2 C163.2 CN19.B1(VBUS_B) U41.6(OUT2) U51.1(IO1)
NetL12_2: L12.2 U41.2(IN)
NetLD12_1: LD12.1 R101.1
NetR95_2: R95.2 R97.1 U34.25(HS_IND/CFG_SEL1)
NetR98_2: R98.2 R100.1 U34.22(SDA/SMBDATA/NON_REM1)
NetR99_1: R99.1 R105.2 U34.24(SCL/SMBCLK/CFG_SEL0)
NetR101_2: R101.2 R102.2 U34.28(SUSP_IND/L_PWR/NON_REM0)
NetR103_1: R103.1 U34.27(VBUS_DET)
NetR104_2: R104.2 U34.26(~{RESET})
NetR106_1: R106.1 U34.21(~{OCS4})
NetR157_1: R157.1 U34.13(~{OCS1})
NetR170_2: R170.2 U34.35(RBIAS)
NetTP32_1: TP32.1 U34.12(PRTPWR1)

Not connected (* = marked no-connect by the designer): U34 8(USBDN4_DM)* 9(USBDN4_DP)* 20(PRTPWR4)*

### Layout directives
differential pair: PCIE.USB_N, PCIE.USB_P, USB1CN_N, USB1CN_P, USB2CN_N, USB2CN_P, USBDN2_N, USBDN2_P, USBDN3_N, USBDN3_P, USBH_N, USBH_P

### Notes on the sheet
- USB_HUB
- Default I2C Address: 1010000X
- Title:
- Project:
- Size:
- Revision:
- Variant:
- A3
- -
- Date:
- Reference:
- Sheet:
- of
- (in symbol MCD-00145) Upstream; Downstream 1; Downstream 2; Downstream 3; Downstream 4; Config; Common

### Library data of the parts
C115 C126 = MCD-00674: Capacitor, MLCC, 6.8pF, 50V, NPO, +/-0.25pF, 0402, T=0.5mm; Manufacturer_Part_Number: CC0402CRNPO9BN6R8; Manufacturer: YAGEO; Part_Preference: Recommended; Component_Country_Of_Origin: China; ID: 3068; ShowFields: YES; Internal_Part_Number: MCD-00674; Status: Released; Part_Type: Capacitor; Package: 0402; ComponentLink1URL: http://tunmcdsvn.tun.st.com/Component_Documentation_Library/Trunk/Capacitor/YAGEO_NP0_Series; Order_Code_Digikey: 311-3327-1-ND; Order_Code_Farnell: N/A; Order_Code_RS: N/A
C119 C128 C146 C155 C163 C273 C275 C276 C283-C285 = MCD-00006: Capacitor, MLCC, 100nF, 16V, X7R, +/-10%, 0402, T=0.5mm; Manufacturer_Part_Number: CC0402KRX7R7BB104; Manufacturer: YAGEO; Part_Preference: Recommended; Order_Code_RS: 616-9701; Component_Country_Of_Origin: China; ID: 2474; ShowFields: YES; Internal_Part_Number: MCD-00006; Status: Released; Part_Type: Capacitor; Package: 0402; ComponentLink1URL: http://tunmcdsvn.tun.st.com/Component_Documentation_Library/Trunk/Capacitor/YAGEO_X7R_Series; Order_Code_Digikey: 311-1338-1-ND; Order_Code_Farnell: 9402047
C143 = MCD-00204: Capacitor, MLCC, 47uF, 10V, X5R, +/-20%, 0805, T=1.25mm; Part_Preference: Recommended; Manufacturer: MURATA; Manufacturer_Part_Number: GRM21BR61A476ME15K; Component_Country_Of_Origin: Japan; ShowFields: YES; ID: 2664; Internal_Part_Number: MCD-00204; Status: Checked; Part_Type: Capacitor; Package: 0805; ComponentLink1URL: http://tunmcdsvn.tun.st.com/Component_Documentation_Library/Trunk/Capacitor/MURATA_GRM_Series; Order_Code_Digikey: GRM21BR61A476ME15K-ND; Order_Code_Farnell: N/A; Order_Code_RS: N/A
C150 C161 = MCD-00104: Capacitor, MLCC, 220uF, 6V3, X5R, +/-20%, 1206, T=1.6mm; Manufacturer_Part_Number: GRM31CR60J227ME11; Manufacturer: MURATA; Part_Preference: Recommended; Order_Code_RS: 170-6396; Component_Country_Of_Origin: Japan; ID: 2764; ShowFields: YES; Internal_Part_Number: MCD-00104; Status: Released; Part_Type: Capacitor; Package: 1206; ComponentLink1URL: http://tunmcdsvn.tun.st.com/Component_Documentation_Library/Trunk/Capacitor/MURATA_GRM_Series; Order_Code_Digikey: 490-13970-1-ND; Order_Code_Farnell: 2494472
C277 = MCD-01356: Capacitor, MLCC, 4.7uF, 6V3, X5R, +/-20%, 0402, T=0.5mm; Manufacturer_Part_Number: GRM155R60J475ME47; Manufacturer: MURATA; Part_Preference: Recommended; Order_Code_RS: 814-5230; Component_Country_Of_Origin: Japan; ID: 3456; ShowFields: YES; Internal_Part_Number: MCD-01356; Status: Released; Part_Type: Capacitor; Package: 0402; ComponentLink1URL: http://tunmcdsvn.tun.st.com/Component_Documentation_Library/Trunk/Capacitor/MURATA_GRM_Series; Order_Code_Digikey: 490-5915-1-ND; Order_Code_Farnell: 2666407
CN19 = MCD-00109: USB_Dual-TypeA, Receptacle, 8pins, 2.5mm, RA, TH, T= 15.5mm; Manufacturer: CONEXCON; Part_Type: Connector; Part_Preference: Recommended; Component_Country_Of_Origin: Unknown; ID: 2756; ShowFields: YES; Internal_Part_Number: MCD-00109; Manufacturer_Part_Number: 5600-3081; Status: Released; ComponentLink1URL: http://tunmcdsvn.tun.st.com/Component_Documentation_Library/Trunk/Connector/CONEXCON_5600_Series/; Order_Code_Digikey: N/A; Order_Code_Farnell: N/A; Order_Code_RS: N/A
L12 = MCD-00305: Ferrite bead, 26R @ 100Mhz, +/-25%, 6000mA, 0R007, 0603, T=0.75mm; Manufacturer_Part_Number: BLM18KG260TN1; Manufacturer: MURATA; Part_Type: Inductor; Part_Preference: Recommended; Order_Code_RS: 747-4723; Component_Country_Of_Origin: Japan; ID: 2564; ShowFields: YES; Internal_Part_Number: MCD-00305; Status: Checked; ComponentLink1URL: http://tunmcdsvn.tun.st.com/Component_Documentation_Library/Trunk/Inductor/MURATA_BLM_Series; Order_Code_Digikey: 490-5252-2-ND; Order_Code_Farnell: 1781087; Package: 0603
LD12 = MCD-00587: LED Red, 0603 SMD, 2V Forward Voltage; Part_Type: Display; Manufacturer_Part_Number: VLMS1300-GS08; Manufacturer: VISHAY; Alternate_Manufacturer_Part_Number: LS Q976-NR-1; Alternate_Manufacturer: OSRAM OPTO SEMICONDUCTORS; Alternate_Internal_Part_Number: MCD-02401; Part_Preference: Recommended; Provided_By: SUBCO; Component_Country_Of_Origin: China; ID: 3154; ShowFields: YES; Internal_Part_Number: MCD-00587; Status: Released; Package: LED 0603; ComponentLink1Description: Datasheet; ComponentLink1URL: http://tunmcdsvn.tun.st.com/Component_Datasheet_Library/Trunk/Display/VISHAY_LED_RED_VLMS1300-GS08; Order_Code_Digikey: VLMS1300-GS08CT-ND; Order_Code_Farnell: 2078728; ECCN_US: n/a; ECCN_EU: n/a
R95 R97-R100 R102 R105 = MCD-00059: Resistor, 100K, 0402, +/-1%, 1/16W; Manufacturer_Part_Number: RC0402FR-07100KL; Manufacturer: YAGEO; Part_Preference: Recommended; Component_Country_Of_Origin: China; ID: 2533; ShowFields: YES; Internal_Part_Number: MCD-00059; Status: Released; Part_Type: Resistor; ComponentLink1URL: http://tunmcdsvn.tun.st.com/Component_Documentation_Library/Trunk/Resistor/YAGEO_RC_L_Series; Package: 0402; Order_Code_Digikey: 311-100KLRTR-ND; Order_Code_Farnell: 2421891; Order_Code_RS: N/A
R101 = MCD-00061: Resistor, 1K, 0402, +/-1%,1/16W; Manufacturer_Part_Number: RC0402FR-071KL; Manufacturer: YAGEO; Part_Preference: Recommended; Component_Country_Of_Origin: China; ID: 2532; ShowFields: YES; Internal_Part_Number: MCD-00061; Status: Released; Part_Type: Resistor; ComponentLink1URL: http://tunmcdsvn.tun.st.com/Component_Documentation_Library/Trunk/Resistor/YAGEO_RC_L_Series; Package: 0402; Order_Code_Digikey: 311-1.00KLRCT-ND; Order_Code_Farnell: 9239235; Order_Code_RS: N/A
R103 R104 R106 R157 R323 R324 = MCD-00053: Resistor, 10K, 0402, +/-1%, 1/16W; Manufacturer_Part_Number: RC0402FR-0710KL; Manufacturer: YAGEO; BMS_Part_Number: 9131590; Part_Preference: Recommended; Component_Country_Of_Origin: China; ID: 2539; ShowFields: YES; Internal_Part_Number: MCD-00053; Status: Released; Part_Type: Resistor; ComponentLink1URL: http://tunmcdsvn.tun.st.com/Component_Documentation_Library/Trunk/Resistor/YAGEO_RC_L_Series; Package: 0402; Order_Code_Digikey: 311-10.0KLRCT-ND; Order_Code_Farnell: 9239359; Order_Code_RS: N/A
R170 = MCD-00187: Resistor, 12K, 0402, +/-1%, 1/16W; Manufacturer_Part_Number: RC0402FR-0712KL; Manufacturer: YAGEO; BMS_Part_Number: 9131030; Part_Preference: Recommended; Component_Country_Of_Origin: China; ID: 2678; ShowFields: YES; Internal_Part_Number: MCD-00187; Status: Released; Part_Type: Resistor; ComponentLink1URL: http://tunmcdsvn.tun.st.com/Component_Documentation_Library/Trunk/Resistor/YAGEO_RC_L_Series; Package: 0402; Order_Code_Digikey: 311-12.0KLRCT-ND; Order_Code_Farnell: 9239367; Order_Code_RS: N/A
TP32 = MCD-00074: Test Point 1mm; Part_Type: Misc; Part_Preference: Recommended; ID: 2518; ShowFields: YES; Internal_Part_Number: MCD-00074; Status: Released; Manufacturer_Part_Number: n/a; Manufacturer: n/a; ComponentLink1URL: http://na; Order_Code_Digikey: N/A; Order_Code_Farnell: N/A; Order_Code_RS: N/A
U34 = MCD-00145: USB HUB 2,0 Controller; Manufacturer: MICROCHIP; Part_Type: IC; Part_Preference: Recommended; Component_Country_Of_Origin: Unknown; ID: 2724; ShowFields: YES; Value: USB2514B-AEZC; Internal_Part_Number: MCD-00145; Manufacturer_Part_Number: USB2514B-AEZC; Status: Released; ComponentLink1URL: http://tunmcdsvn.tun.st.com/Component_Datasheet_Library/Trunk/IC/Microchip_HS Hub Controller_USB2514B-AEZC; Order_Code_Digikey: N/A; Order_Code_Farnell: N/A; Order_Code_RS: N/A
U41 = MCD-00123: IC,Dual-Channel-Power-Switch,500mA,100mR,SO8; Manufacturer: STMICROELECTRONICS; BMS_Part_Number: 9159012; Part_Preference: Recommended; Manufacturer_HQ_COO: EU; Component_Country_Of_Origin: China; ID: 2746; ShowFields: YES; Value: STMPS2252MTR; Internal_Part_Number: MCD-00123; Manufacturer_Part_Number: STMPS2252MTR; Status: Released; Part_Type: IC; ComponentLink1URL: http://tunmcdsvn.tun.st.com/Component_Datasheet_Library/Trunk/IC/STM_PWR_switch_STMPS2252MTR; Order_Code_Digikey: N/A; Order_Code_Farnell: N/A; Order_Code_RS: N/A
U44 U51 = MCD-01026: High power transient voltage suppressor; Part_Type: Diode; Manufacturer: STMICROELECTRONICS; BMS_Part_Number: 9179046; Part_Preference: Recommended; Manufacturer_HQ_COO: EU; Component_Country_Of_Origin: China; ID: 2997; ShowFields: YES; Internal_Part_Number: MCD-01026; Status: Released; Manufacturer_Part_Number: ESDA7P120-1U1M; Package: QFN1610; ComponentLink1URL: http://tunmcdsvn.tun.st.com/Component_Datasheet_Library/Trunk/Diodes/STM_ESD_ESDA7P120-1U1M
U45 U46 = MCD-03060: ESD protection & Common Filter High Speed serial Interfaces , 0.4 pitch; Part_Type: IC; Part_Preference: Recommended; Manufacturer: STMICROELECTRONICS; ShowFields: YES; ID: 5176; Component_Country_Of_Origin: China; ComponentLink1Description: Datasheet; ComponentLink1URL: http://tunmcdsvn.tun.st.com/Component_Documentation_Library/Trunk/IC/STMICROELECTRONICS_ECMF4-40A100N10; Internal_Part_Number: MCD-03060; Value: ECMF2-40A100N6; Status: Checked; Manufacturer_Part_Number: ECMF2-40A100N6; Package: uQFN-6; Order_Code_Digikey: 497-ECMF2-40A100N6; Order_Code_Farnell: 3993603; Order_Code_RS: N/A
X3 = MCD-01036: Crystal, 24MHz, 6pF, +/-20ppm, 80R, 2x1.6mm; Part_Type: Crystal_Osc; Manufacturer_Part_Number: NX2016SA-24MHZ-EXS00A-CS10820; Manufacturer: NDK; BMS_Part_Number: 9157045; Part_Preference: Recommended; Component_Country_Of_Origin: Unknown; ID: 2989; ShowFields: YES; Internal_Part_Number: MCD-01036; Status: Released; Package: 2x1.6mm; ComponentLink1URL: http://tunmcdsvn.tun.st.com/Component_Documentation_Library/Trunk/Crytal_Oscillator/NDK_NX2016SA_Series; Order_Code_Digikey: 644-1365; Order_Code_Farnell: N/A; Order_Code_RS: N/A